# EAGLE design S111E (EAGLE 6.6.0)
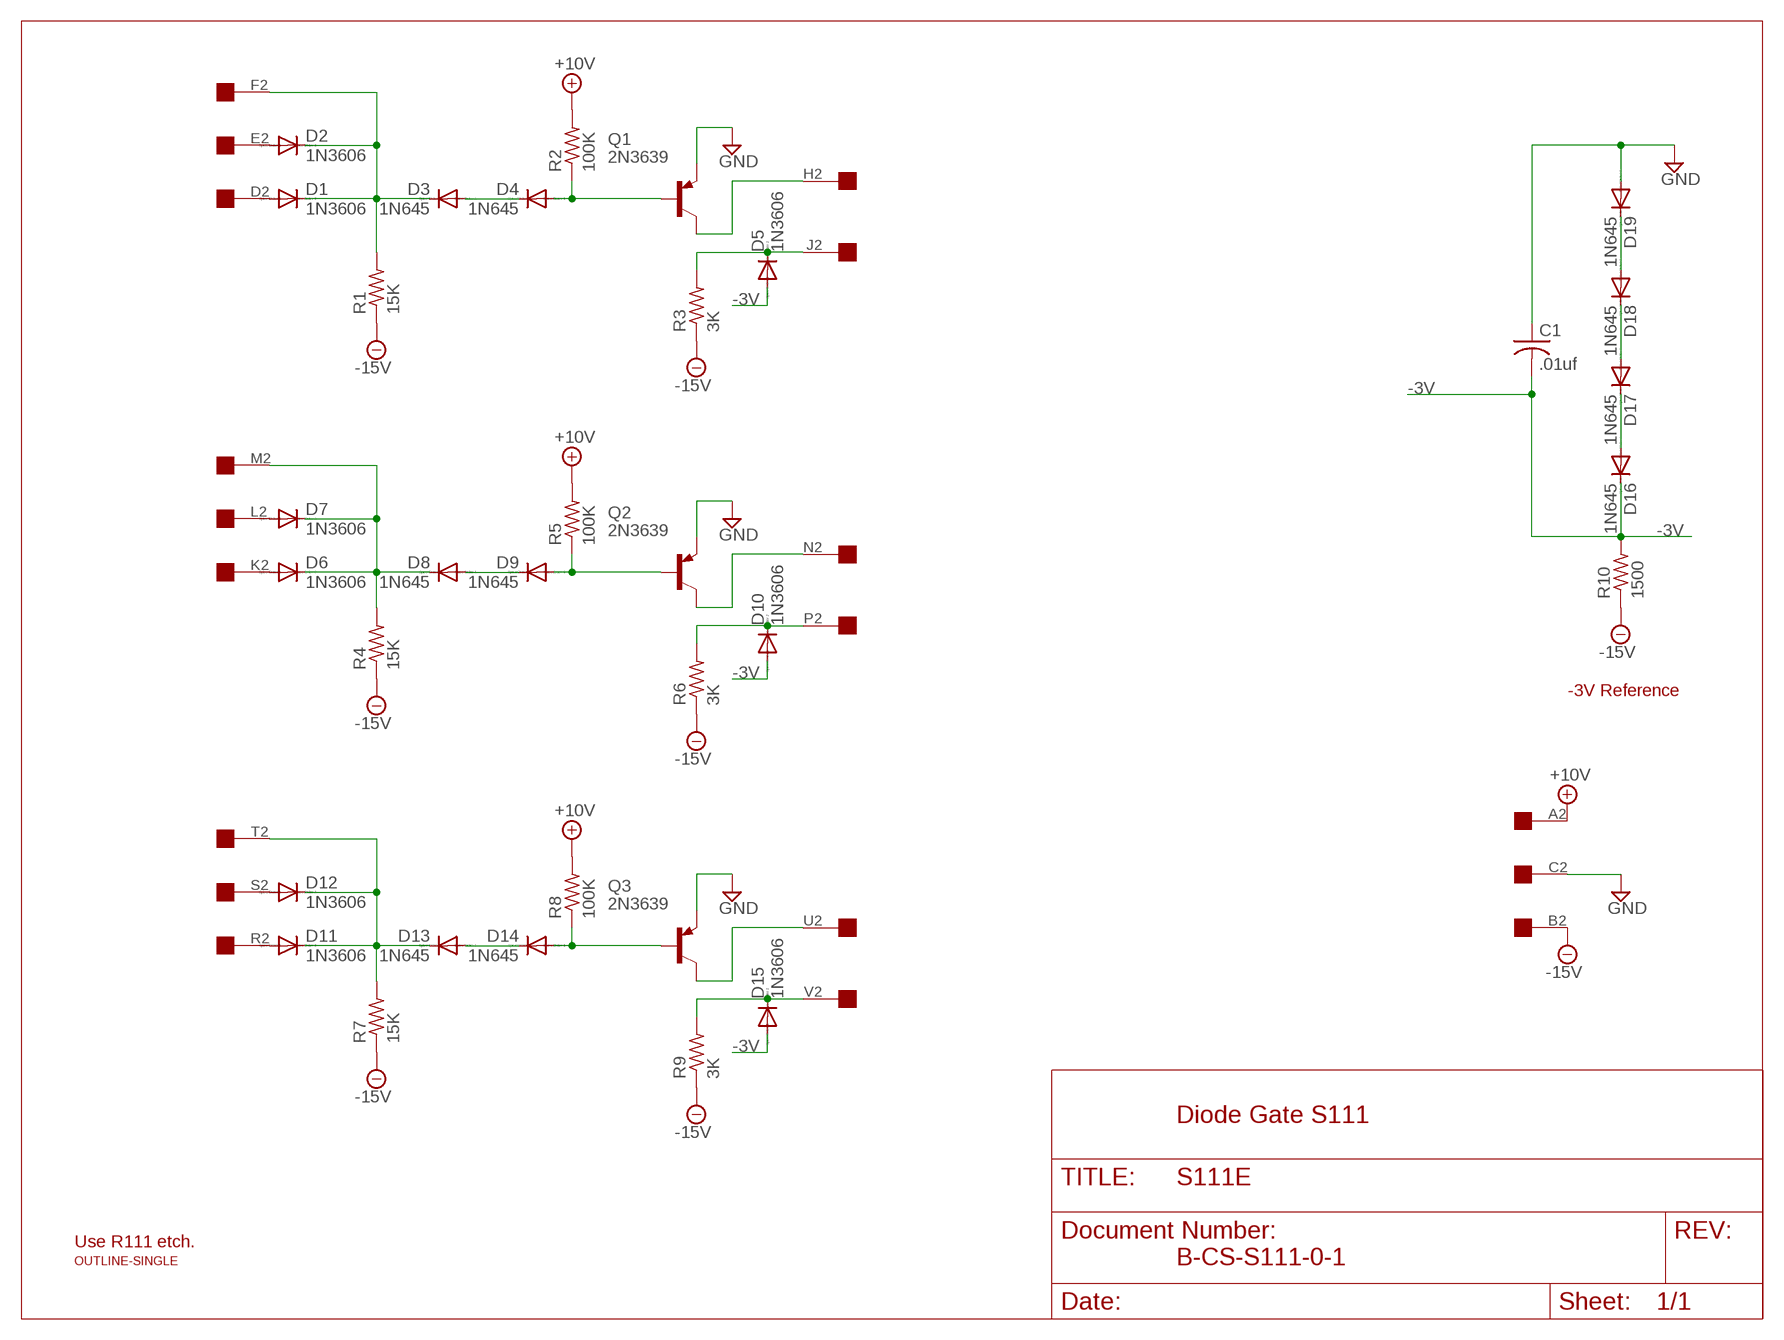
[diagram p0: schematic, sheet 1]

## Parts
C1  .01uf  C-US050-025X075  [C050-025X075]
D1  1N3606  1N4148DO35-10  [DO35-10]
D2  1N3606  1N4148DO35-10  [DO35-10]
D3  1N645  1N4148DO35-10  [DO35-10]
D4  1N645  1N4148DO35-10  [DO35-10]
D5  1N3606  1N4148DO35-10  [DO35-10]
D6  1N3606  1N4148DO35-10  [DO35-10]
D7  1N3606  1N4148DO35-10  [DO35-10]
D8  1N645  1N4148DO35-10  [DO35-10]
D9  1N645  1N4148DO35-10  [DO35-10]
D10  1N3606  1N4148DO35-10  [DO35-10]
D11  1N3606  1N4148DO35-10  [DO35-10]
D12  1N3606  1N4148DO35-10  [DO35-10]
D13  1N645  1N4148DO35-10  [DO35-10]
D14  1N645  1N4148DO35-10  [DO35-10]
D15  1N3606  1N4148DO35-10  [DO35-10]
D16  1N645  1N4148DO35-10  [DO35-10]
D17  1N645  1N4148DO35-10  [DO35-10]
D18  1N645  1N4148DO35-10  [DO35-10]
D19  1N645  1N4148DO35-10  [DO35-10]
Q1  2N3639  2N3637  [TO39]
Q2  2N3639  2N3637  [TO39]
Q3  2N3639  2N3637  [TO39]
R1  15K  R-US_0207/10  [0207/10]
R2  100K  R-US_0207/10  [0207/10]
R3  3K  R-US_0207/10  [0207/10]
R4  15K  R-US_0207/10  [0207/10]
R5  100K  R-US_0207/10  [0207/10]
R6  3K  R-US_0207/10  [0207/10]
R7  15K  R-US_0207/10  [0207/10]
R8  100K  R-US_0207/10  [0207/10]
R9  3K  R-US_0207/10  [0207/10]
R10  1500  R-US_0207/10  [0207/10]
U$1  OUTLINE-SINGLE  [SINGLE]
U$2  EDGE-1  [EDGE-CON1]

## Nets
+10V [Power]: R2.2 R5.2 R8.2 U$2.A2
-3V [Power]: C1.2 D5.A D10.A D15.A D16.C R10.2
-15V [Power]: R1.1 R3.1 R4.1 R6.1 R7.1 R9.1 R10.1 U$2.B2
GND [Power]: C1.1 D19.A Q1.1(E) Q2.1(E) Q3.1(E) U$2.C2
N$1: D6.A U$2.K2
N$2: D9.A Q2.2(B) R5.1
N$3: D18.A D19.C
N$4: D10.C R6.2 U$2.P2
N$5: Q1.3(C) U$2.H2
N$6: D6.C D7.C D8.C R4.2 U$2.M2
N$7: D8.A D9.C
N$8: D14.A Q3.2(B) R8.1
N$9: D15.C R9.2 U$2.V2
N$10: D11.A U$2.R2
N$11: D11.C D12.C D13.C R7.2 U$2.T2
N$12: D13.A D14.C
N$13: D17.A D18.C
N$14: D7.A U$2.L2
N$15: Q2.3(C) U$2.N2
N$16: D16.A D17.C
N$17: Q3.3(C) U$2.U2
N$19: D4.A Q1.2(B) R2.1
N$20: D5.C R3.2 U$2.J2
N$21: D1.A U$2.D2
N$22: D1.C D2.C D3.C R1.2 U$2.F2
N$23: D3.A D4.C
N$31: D12.A U$2.S2
N$39: D2.A U$2.E2

## Notes on the sheet
- -3V Reference
- Diode Gate S111
- Use R111 etch.
- B-CS-S111-0-1

## Library data of the parts
C1 = rcl:C-US: CAPACITOR, American symbol
D1-D19 = diode:1N4148: DIODE high speed (Philips)
Q1-Q3 = transistor-pnp:2N3637*: PNP Transistror
R1-R10 = rcl:R-US_: RESISTOR, American symbol
U$1 = dec-con:OUTLINE-*: Board outlines for DEC boards.
U$2 = dec-con:EDGE-1: Single-Sided DEC Edge Connector -- (side 2)

## Net classes
1 Power: width 0.813 mm

## Board
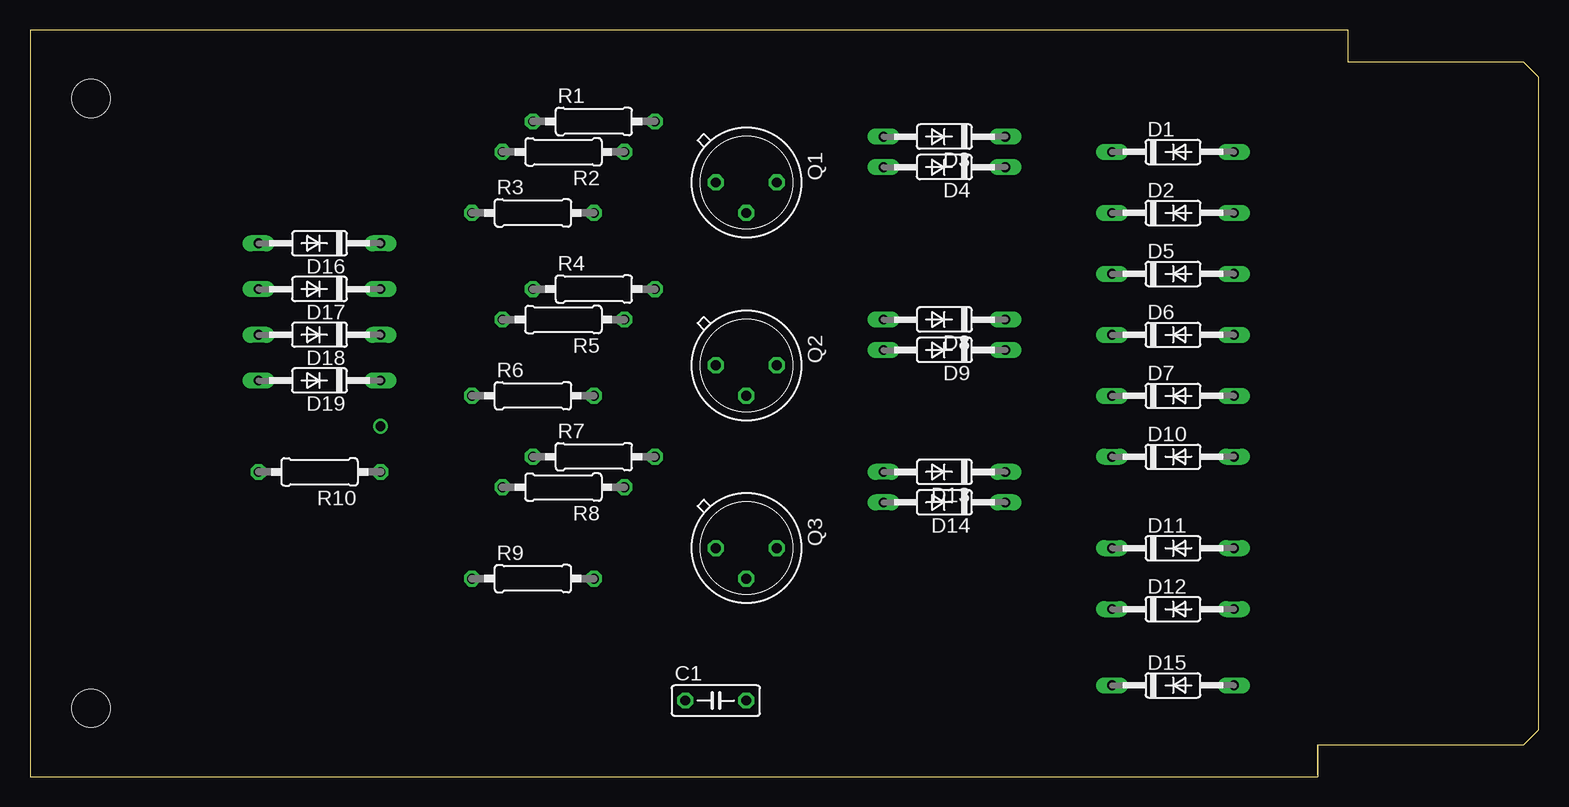
[diagram p1: board, top side]
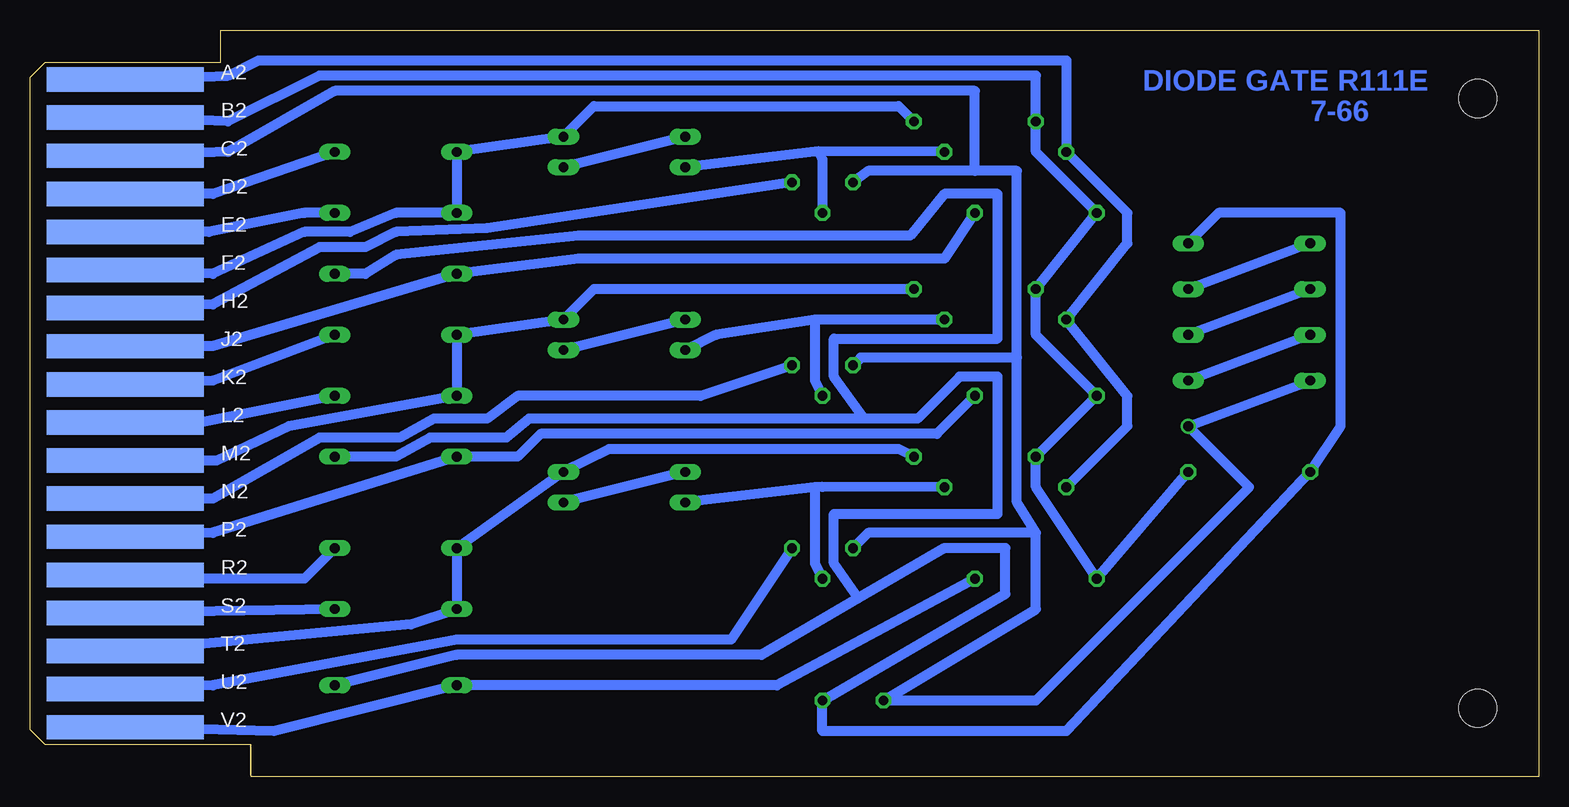
[diagram p2: board, bottom side, seen from below]

Size 125.73 x 62.23 mm. Coordinates in mm from the lower left corner, seen from the top.
Copper layers (1+16): Top 0.035mm / dielectric 1.5mm / Bottom 0.035mm
Design rules "16mils": minimum track width 16mil, minimum drill 32mil, track to track 15mil, track to pad 10mil, pad to pad 10mil, via to via 10mil, smd to smd 10mil, copper to edge 13mil, drill to drill 10mil, minimum pad ring 10mil, minimum via ring 8mil, stop-mask expansion 0mil, vias tented up to drill 0mil, thermal gap 10mil

### Footprints (pad centres in the part's own frame; a part is rotated, then mirrored left to right if it is on the bottom)
C050-025X075 = drill 0.813 octagon: 1 -2.54,0; 2 2.54,0
DO35-10 = drill 0.813 long: A 5.08,0; C -5.08,0
TO39 = drill 0.813 octagon: 1 0,-2.54; 2 2.54,0; 3 0,2.54
0207/10 = drill 0.813 octagon: 1 -5.08,0; 2 5.08,0
SINGLE = hole 3.175: 120.65,56.515; 120.65,5.715
EDGE-CON1 = smd 13.106 x 2.032 bottom: A2 7.938,4.128; B2 7.938,7.303; C2 7.938,10.477; D2 7.938,13.652; E2 7.938,16.828; F2 7.938,20.003; H2 7.938,23.177; J2 7.938,26.352; K2 7.938,29.527; L2 7.938,32.703; M2 7.938,35.877; N2 7.938,39.053; P2 7.938,42.227; R2 7.938,45.403; S2 7.938,48.578; T2 7.938,51.752; U2 7.938,54.928; V2 7.938,58.102

### Placement (x,y rotation side)
C1  57.15,6.35 0 top
D1  95.25,52.07 0 top
D2  95.25,46.99 0 top
D3  76.2,53.34 180 top
D4  76.2,50.8 180 top
D5  95.25,41.91 0 top
D6  95.25,36.83 0 top
D7  95.25,31.75 0 top
D8  76.2,38.1 180 top
D9  76.2,35.56 180 top
D10  95.25,26.67 0 top
D11  95.25,19.05 0 top
D12  95.25,13.97 0 top
D13  76.2,25.4 180 top
D14  76.2,22.86 180 top
D15  95.25,7.62 0 top
D16  24.13,44.45 180 top
D17  24.13,40.64 180 top
D18  24.13,36.83 180 top
D19  24.13,33.02 180 top
Q1  59.69,49.53 270 top
Q2  59.69,34.29 270 top
Q3  59.69,19.05 270 top
R1  46.99,54.61 0 top
R2  44.45,52.07 180 top
R3  41.91,46.99 0 top
R4  46.99,40.64 0 top
R5  44.45,38.1 180 top
R6  41.91,31.75 0 top
R7  46.99,26.67 0 top
R8  44.45,24.13 180 top
R9  41.91,16.51 0 top
R10  24.13,25.4 180 top
U$1  125.73,62.23 180 top
U$2  125.73,62.23 180 top

### Tracks (layer width: path | path; a pad name or v marks a point on that pad's centre or on a via)
+10V
  Bottom 0.813: R8.2 34.29,29.21 34.29,31.75 R5.2 34.29,44.45 34.29,46.99 R2.2 39.37,59.69 106.68,59.69 109.22,58.42 U$2.A2
-3V
  Bottom 0.813: D16.C 26.67,46.99 16.51,46.99 16.51,29.21 R10.2 39.37,3.81 59.69,3.81 C1.2 44.45,15.24 44.45,19.05 49.53,19.05 56.72,14.86 | 56.72,14.86 64.77,10.16 90.17,10.16 D15.A | D10.A 95.25,26.67 92.39,28.26 86.04,28.26 84.14,29.84 56.2,29.84 | 56.2,29.84 51.75,29.84 48.26,33.34 45.09,33.34 45.09,21.91 58.74,21.91 58.74,17.78 56.72,14.86 | D5.A 97.79,41.91 95.25,43.5 80.01,45.08 52.39,45.08 49.53,48.58 45.09,48.58 45.09,36.51 58.74,36.51 58.74,33.34 56.2,29.84
-15V
  Bottom 0.813: R10.1 R9.1 41.91,24.13 R7.1 R6.1 41.91,36.83 R4.1 R3.1 41.91,52.07 R1.1 41.91,58.42 101.6,58.42 109.22,54.61 U$2.B2
GND  (via drill 0.81)
  Bottom 0.813: 41.91,20.32 41.91,13.97 C1.1 41.91,6.35 24.13,24.13 v29.21,29.21 D19.A | 41.91,20.32 43.5,22.86 43.5,34.92 | 43.5,34.92 43.5,50.48 46.99,50.48 | 46.99,50.48 55.88,50.48 Q1.1 | 41.91,20.32 55.88,20.32 Q3.1 | 43.5,34.92 56.52,34.92 Q2.1 | U$2.C2 109.22,52.07 100.33,57.15 46.99,57.15 46.99,50.48
N$1
  Bottom 0.813: D6.A 110.49,33.02 U$2.K2
N$2
  Bottom 0.813: 60.33,38.1 60.33,33.02 Q2.2 | R5.1 60.33,38.1 | 60.33,38.1 68.58,36.83 D9.A
N$3
  Bottom 0.813: D18.A D19.C
N$4
  Bottom 0.813: R6.2 50.17,28.57 83.19,28.57 85.09,26.67 D10.C 110.49,20.32 U$2.P2
N$5
  Bottom 0.813: U$2.H2 110.49,39.37 101.6,44.13 97.79,44.13 95.25,45.4 87.63,45.72 Q1.3
N$6
  Bottom 0.813: U$2.M2 110.17,26.35 104.14,29.21 D7.C D6.C D8.C 78.74,40.64 R4.2
N$7
  Bottom 0.813: D8.A D9.C
N$8
  Bottom 0.813: R8.1 59.69,24.17 60.33,24.13 | 60.33,24.13 D14.A | 60.33,24.13 60.33,17.78 Q3.2
N$9
  Bottom 0.813: R9.2 63.5,7.62 D15.C 105.41,3.81 U$2.V2
N$10
  Bottom 0.813: D11.A 102.87,16.51 113.03,16.51 U$2.R2
N$11
  Bottom 0.813: U$2.T2 93.98,12.7 D12.C D11.C D13.C 77.47,27.3 53.34,27.3 R7.2
N$12
  Bottom 0.813: D13.A D14.C
N$13
  Bottom 0.813: D17.A D18.C
N$14
  Bottom 0.813: D7.A 113.03,29.21 U$2.L2
N$15
  Bottom 0.813: Q2.3 69.85,31.75 85.09,31.75 87.63,29.84 92.08,29.84 94.93,28.26 101.6,28.26 110.49,23.18 U$2.N2
N$16
  Bottom 0.813: D16.A D17.C
N$17
  Bottom 0.813: U$2.U2 110.49,7.62 90.17,11.43 67.31,11.43 Q3.3
N$19
  Bottom 0.813: R2.1 60.01,52.11 | 60.01,52.11 D4.A | 60.01,52.11 59.69,51.43 Q1.2
N$20
  Bottom 0.813: U$2.J2 110.49,35.88 D5.C 80.01,43.18 49.53,43.18 R3.2
N$21
  Bottom 0.813: D1.A 110.49,48.58 U$2.D2
N$22
  Bottom 0.813: U$2.F2 110.49,41.91 102.87,45.4 99.06,45.4 95.25,46.99 D2.C D1.C D3.C 78.74,55.88 53.34,55.88 R1.2
N$23
  Bottom 0.813: D3.A D4.C
N$31
  Bottom 0.813: D12.A U$2.S2
N$39
  Bottom 0.813: D2.A 102.87,46.99 110.81,45.4 U$2.E2

### Text on the board
Bottom: DIODE GATE R111E | 7-66